# EAGLE schematic RangkaianPSU12V_&_RangkaianStepdown5v (EAGLE 9.6.2)
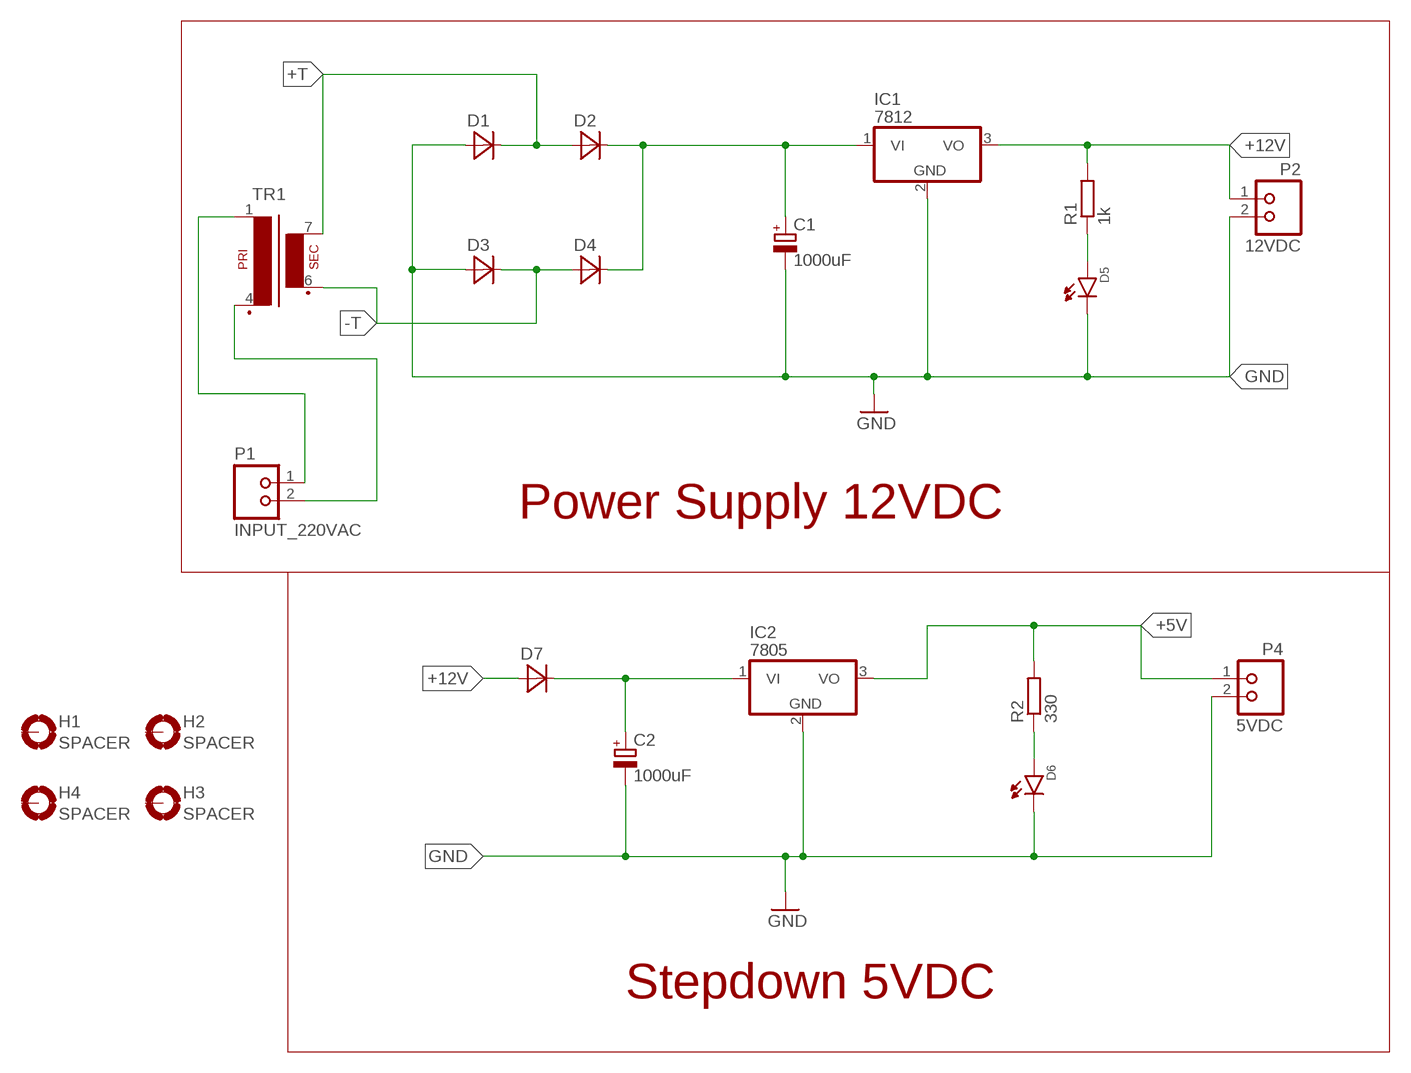
[diagram p0: schematic, sheet 1]

## Parts
C1  1000uF  CAPACITOR_POLARE5-4  [E5-4]
C2  1000uF  CAPACITOR_POLARE5-4  [E5-4]
D1  1N4148  [DO35-10]
D2  1N4148  [DO35-10]
D3  1N4148  [DO35-10]
D4  1N4148  [DO35-10]
D5  LED-3MM  [LED]
D6  LED-3MM  [LED]
D7  1N4148  [DO35-10]
H1  SPACER  [3,0-PAD]
H2  SPACER  [3,0-PAD]
H3  SPACER  [3,0-PAD]
H4  SPACER  [3,0-PAD]
IC1  7812  7812TV  [TO220V]
IC2  7805  7805TV  [TO220V]
P1  INPUT_220VAC  T-BLOCK  [TERMINAL_2P]
P2  12VDC  T-BLOCK  [TERMINAL_2P]
P4  5VDC  T-BLOCK  [TERMINAL_2P]
R1  1k  RESISTORAXIAL  [AXIAL]
R2  330  RESISTORAXIAL  [AXIAL]
TR1  EE20-1  [EE20-1]

## Nets
+5V: IC2.3(VO) P4.1 R2.2
+12V: D7.A IC1.3(VO) P2.1 R1.2
+T: D1.K D2.A TR1.7(S4)
-T: D3.K D4.A TR1.6(S3)
GND: C1.- C2.- D1.A D3.A D5.2 D6.2 IC1.2(GND) IC2.2(GND) P2.2 P4.2
N$1: P1.1 TR1.1
N$2: P1.2 TR1.4(P2)
N$3: C1.+ D2.K D4.K IC1.1(VI)
N$7: D5.1 R1.1
N$9: C2.+ D7.K IC2.1(VI)
N$10: D6.1 R2.1
Unconnected: H1.B3,0(MOUNT) H2.B3,0(MOUNT) H3.B3,0(MOUNT) H4.B3,0(MOUNT)

## Notes on the sheet
- Power Supply 12VDC
- Stepdown 5VDC

## Library data of the parts
C1 C2 = 00-LKS-PROV-JATENG-A3:CAPACITOR_POLAR: POLARIZED CAPACITOR, European symbol; SPICEPREFIX: C
D1-D4 = 00-lksprov2021-A1:1N4148
D5 D6 = 00-LKS-PROV-JATENG-A3:LED-3MM
D7 = 01:1N4148
H1-H4 = LIBRARY LKS BARU:SPACER: MOUNTING PAD, round
IC1 IC2 = linear:78*: Positive VOLTAGE REGULATOR Source: http://cache.national.com/ds/LM/LM78L05.pdf http://www.fairchildsemi.com/ds/LM/LM7805.pdf
P1 P2 P4 = 00-lksprov2021-A1:T-BLOCK
R1 R2 = 00-LKS-PROV-JATENG-A3:RESISTOR: RESISTOR, European symbol; SPICEPREFIX: R
TR1 = trafo:EE20-1: TRANSFORMER 1 primary winding, 1 secondary winding ERA